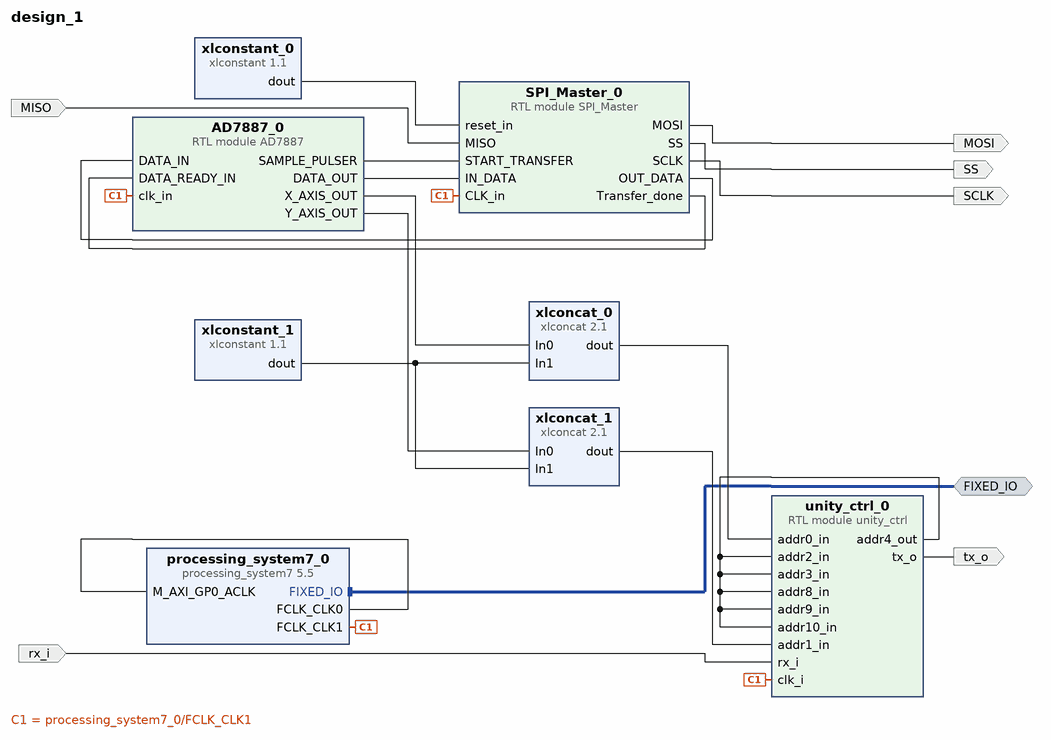
[diagram p0: block diagram of the top level]
# Vivado block design design_1, xc7z010clg225-1, Vivado 2016.3
create_bd_design design_1

create_bd_intf_port -mode Master -vlnv xilinx.com:display_processing_system7:fixedio_rtl:1.0 FIXED_IO
create_bd_port -dir I rx_i
create_bd_port -dir O tx_o
create_bd_port -dir I MISO
create_bd_port -dir O SS
create_bd_port -dir O MOSI
create_bd_port -dir O SCLK

create_bd_cell -type ip -vlnv xilinx.com:ip:processing_system7:5.5 processing_system7_0
set_property -dict [list \
  CONFIG.PCW_FCLK_CLK1_BUF TRUE \
  CONFIG.PCW_APU_PERIPHERAL_FREQMHZ 666.666666 \
  CONFIG.PCW_FPGA0_PERIPHERAL_FREQMHZ 50 \
  CONFIG.PCW_FPGA1_PERIPHERAL_FREQMHZ 200 \
  CONFIG.PCW_M_AXI_GP0_FREQMHZ 50 \
  CONFIG.PCW_NUM_F2P_INTR_INPUTS 1 \
  CONFIG.PCW_DQ_WIDTH 16 \
  CONFIG.PCW_DQS_WIDTH 2 \
  CONFIG.PCW_DM_WIDTH 2 \
  CONFIG.PCW_MIO_PRIMITIVE 32 \
  CONFIG.PCW_EN_CLK1_PORT 1 \
  CONFIG.PCW_PERIPHERAL_BOARD_PRESET part0 \
  CONFIG.PCW_PRESET_BANK1_VOLTAGE {LVCMOS 3.3V} \
  CONFIG.PCW_UIPARAM_DDR_ENABLE 0 \
  CONFIG.PCW_QSPI_PERIPHERAL_ENABLE 1 \
  CONFIG.PCW_QSPI_QSPI_IO {MIO 1 .. 6} \
  CONFIG.PCW_QSPI_GRP_SINGLE_SS_ENABLE 1 \
  CONFIG.PCW_QSPI_GRP_SINGLE_SS_IO {MIO 1 .. 6} \
  CONFIG.PCW_ENET0_PERIPHERAL_ENABLE 0 \
  CONFIG.PCW_SD0_PERIPHERAL_ENABLE 0 \
  CONFIG.PCW_UART1_PERIPHERAL_ENABLE 0 \
  CONFIG.PCW_USB0_PERIPHERAL_ENABLE 0 \
  CONFIG.PCW_USB_RESET_ENABLE 1 \
  CONFIG.PCW_I2C_RESET_ENABLE 1 \
  CONFIG.PCW_GPIO_MIO_GPIO_ENABLE 1 \
  CONFIG.PCW_GPIO_MIO_GPIO_IO MIO \
  CONFIG.PCW_APU_CLK_RATIO_ENABLE 0.251400462962963 \
  CONFIG.PCW_ENET0_PERIPHERAL_CLKSRC External \
  CONFIG.PCW_UIPARAM_GENERATE_SUMMARY NONE \
  CONFIG.PCW_FPGA_FCLK1_ENABLE 1 \
] [get_bd_cells processing_system7_0]
# 390 more settings of processing_system7_0 are not shown: defaults, MIO pin electricals, DDR timing, and values the tool derives
create_bd_cell -type ip -vlnv xilinx.com:ip:xlconstant:1.1 xlconstant_0
set_property -dict {CONFIG.CONST_VAL 0} [get_bd_cells xlconstant_0]
create_bd_cell -type ip -vlnv xilinx.com:ip:xlconstant:1.1 xlconstant_1
set_property -dict {CONFIG.CONST_WIDTH 20 CONFIG.CONST_VAL 0} [get_bd_cells xlconstant_1]
create_bd_cell -type ip -vlnv xilinx.com:ip:xlconcat:2.1 xlconcat_0
create_bd_cell -type ip -vlnv xilinx.com:ip:xlconcat:2.1 xlconcat_1
create_bd_cell -type module -reference unity_ctrl unity_ctrl_0
create_bd_cell -type module -reference AD7887 AD7887_0
set_property -dict {CONFIG.SAMPLE_FREQ 60000} [get_bd_cells AD7887_0]
create_bd_cell -type module -reference SPI_Master SPI_Master_0
set_property -dict {CONFIG.SCLK_FREQ 1900000} [get_bd_cells SPI_Master_0]

# ---- connections ----

connect_bd_intf_net [get_bd_intf_ports FIXED_IO] [get_bd_intf_pins processing_system7_0/FIXED_IO]
connect_bd_net [get_bd_pins processing_system7_0/FCLK_CLK0] [get_bd_pins processing_system7_0/M_AXI_GP0_ACLK]
connect_bd_net [get_bd_pins processing_system7_0/FCLK_CLK1] \
  [get_bd_pins unity_ctrl_0/clk_i] [get_bd_pins AD7887_0/clk_in] [get_bd_pins SPI_Master_0/CLK_in]
connect_bd_net [get_bd_ports rx_i] [get_bd_pins unity_ctrl_0/rx_i]
connect_bd_net [get_bd_pins unity_ctrl_0/tx_o] [get_bd_ports tx_o]
connect_bd_net [get_bd_pins unity_ctrl_0/addr4_out] \
  [get_bd_pins unity_ctrl_0/addr2_in] [get_bd_pins unity_ctrl_0/addr3_in] [get_bd_pins unity_ctrl_0/addr8_in] \
  [get_bd_pins unity_ctrl_0/addr9_in] [get_bd_pins unity_ctrl_0/addr10_in]
connect_bd_net [get_bd_pins xlconcat_0/dout] [get_bd_pins unity_ctrl_0/addr0_in]
connect_bd_net [get_bd_pins xlconcat_1/dout] [get_bd_pins unity_ctrl_0/addr1_in]
connect_bd_net [get_bd_pins AD7887_0/Y_AXIS_OUT] [get_bd_pins xlconcat_1/In0]
connect_bd_net [get_bd_pins AD7887_0/X_AXIS_OUT] [get_bd_pins xlconcat_0/In0]
connect_bd_net [get_bd_pins xlconstant_1/dout] [get_bd_pins xlconcat_0/In1] [get_bd_pins xlconcat_1/In1]
connect_bd_net [get_bd_pins xlconstant_0/dout] [get_bd_pins SPI_Master_0/reset_in]
connect_bd_net [get_bd_ports MISO] [get_bd_pins SPI_Master_0/MISO]
connect_bd_net [get_bd_pins AD7887_0/SAMPLE_PULSER] [get_bd_pins SPI_Master_0/START_TRANSFER]
connect_bd_net [get_bd_pins SPI_Master_0/OUT_DATA] [get_bd_pins AD7887_0/DATA_IN]
connect_bd_net [get_bd_pins SPI_Master_0/Transfer_done] [get_bd_pins AD7887_0/DATA_READY_IN]
connect_bd_net [get_bd_pins SPI_Master_0/SS] [get_bd_ports SS]
connect_bd_net [get_bd_pins SPI_Master_0/MOSI] [get_bd_ports MOSI]
connect_bd_net [get_bd_pins SPI_Master_0/SCLK] [get_bd_ports SCLK]
connect_bd_net [get_bd_pins AD7887_0/DATA_OUT] [get_bd_pins SPI_Master_0/IN_DATA]

validate_bd_design
save_bd_design
